# EAGLE schematic boarduino_breakout (EAGLE 4.16)
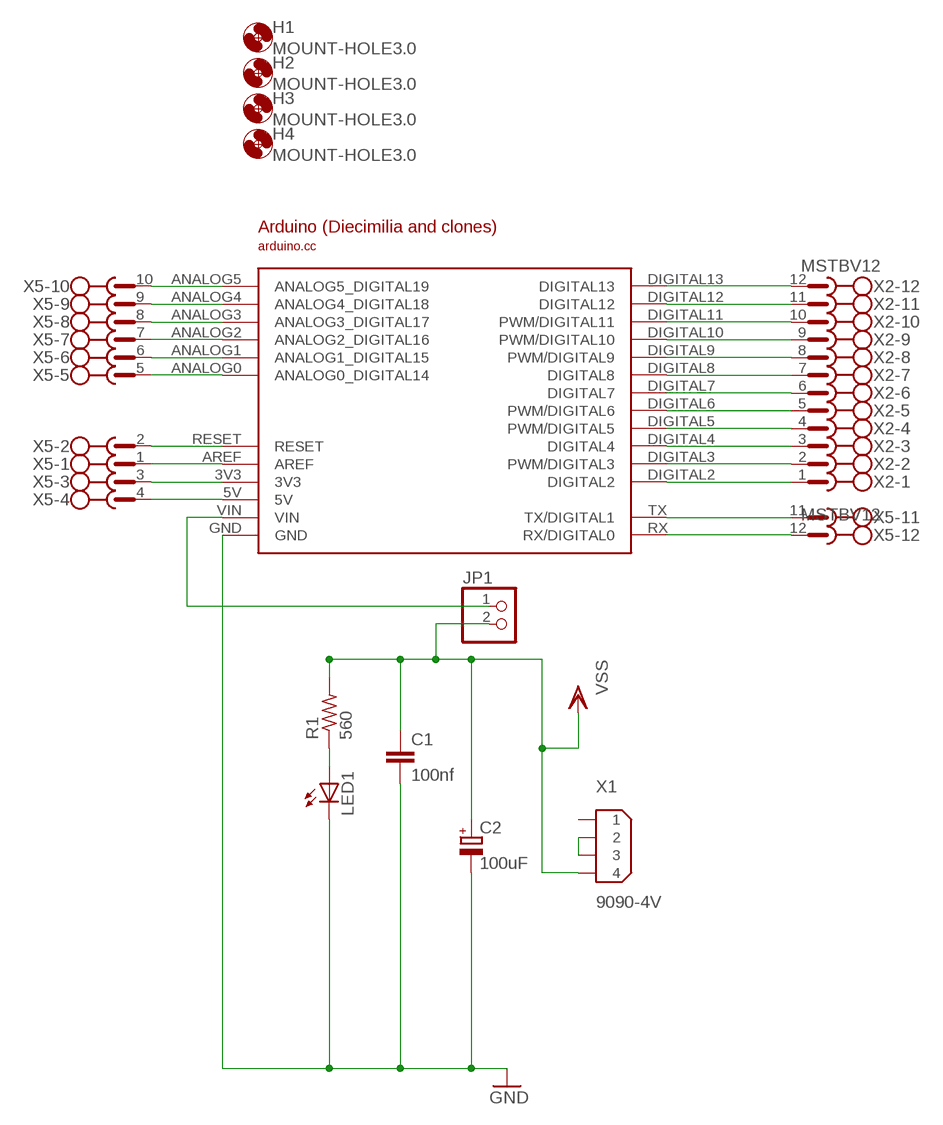
[diagram p0: schematic, sheet 1]

## Parts
C1  100nf  C-EU050-030X075  [C050-030X075]
C2  100uF  CPOL-EUE2.5-7  [E2,5-7]
H1  MOUNT-HOLE3.0  [3,0]
H2  MOUNT-HOLE3.0  [3,0]
H3  MOUNT-HOLE3.0  [3,0]
H4  MOUNT-HOLE3.0  [3,0]
JP1  PINHD-1X2  [1X02]
LED1  LED5MM  [LED5MM]
R1  560  R-US_0207/7  [0207/7]
U$1  ARDUINODIECIMILIA  [ARDUINO]
X1  9090-4V  [9090-4V]
X2  MSTBV12  [MSTBV12]
X5  MSTBV12  [MSTBV12]

## Nets
GND: C1.2 C2.- LED1.K(C) U$1.GND
N$1: LED1.A R1.1
N$2: X1.2 X1.3
N$3: U$1.DIGITAL13 X2.12
N$4: U$1.DIGITAL12 X2.11
N$5: U$1.DIGITAL11(PWM/DIGITAL11) X2.10
N$6: U$1.DIGITAL10(PWM/DIGITAL10) X2.9
N$7: U$1.DIGITAL9(PWM/DIGITAL9) X2.8
N$8: U$1.DIGITAL8 X2.7
N$9: U$1.DIGITAL7 X2.6
N$10: U$1.DIGITAL6(PWM/DIGITAL6) X2.5
N$11: U$1.DIGITAL5(PWM/DIGITAL5) X2.4
N$12: U$1.DIGITAL4 X2.3
N$13: U$1.DIGITAL3(PWM/DIGITAL3) X2.2
N$14: U$1.DIGITAL2 X2.1
N$15: U$1.TX(TX/DIGITAL1) X5.11
N$16: U$1.RX(RX/DIGITAL0) X5.12
N$17: U$1.ANALOG5(ANALOG5_DIGITAL19) X5.10
N$18: U$1.ANALOG4(ANALOG4_DIGITAL18) X5.9
N$19: U$1.ANALOG3(ANALOG3_DIGITAL17) X5.8
N$20: U$1.ANALOG2(ANALOG2_DIGITAL16) X5.7
N$21: U$1.ANALOG1(ANALOG1_DIGITAL15) X5.6
N$22: U$1.ANALOG0(ANALOG0_DIGITAL14) X5.5
N$23: U$1.AREF X5.1
N$24: U$1.RESET X5.2
N$25: U$1.3V3 X5.3
N$26: U$1.5V X5.4
N$27: JP1.1 U$1.VIN
VSS: C1.1 C2.+ JP1.2 R1.2 X1.4
Unconnected: X1.1

## Library data of the parts
C1 = rcl:C-EU: CAPACITOR, European symbol
C2 = rcl:CPOL-EU: POLARIZED CAPACITOR, European symbol
H1-H4 = holes:MOUNT-HOLE: MOUNTING HOLE with drill center marker
JP1 = pinhead:PINHD-1X2: PIN HEADER
LED1 = led:LED: LED OSRAM: - CHIPLED LG R971, LG N971, LY N971, LG Q971, LY Q971, LO R971, LY R971 LH N974, LH R974 LS Q976, LO Q976, LY Q976 LO Q996 - Hyper CHIPLED LW Q18S LB Q993, LB Q99A, LB R99A - SideLED LS A670, LO A670, LY A670, LG A670, LP A670 LB A673, LV A673, LT A673, LW A673 LH A674 LY A675 LS A676, LA A676, LO A676, LY A676, LW A676 LS A679, LY A679, LG A679 - Hyper Micro SIDELED® LS Y876, LA Y876, LO Y876, LY Y876 LT Y87S - SmartLED LW L88C, LW L88S LB L89C, LB L89S, LG L890 LS L89K, LO L89K, LY L89K LS L896, LA L896, LO L896, LY L896 - TOPLED LS T670, LO T670, LY T670, LG T670, LP T670 LSG T670, LSP T670, LSY T670, LOP T670, LYG T670 LG T671, LOG T671, LSG T671 LB T673, LV T673, LT T673, LW T673 LH T674 LS T676, LA T676, LO T676, LY T676, LB T676, LH T676, LSB T676, LW T676 LB T67C, LV T67C, LT T67C, LS T67K, LO T67K, LY T67K, LW E67C LS E67B, LA E67B, LO E67B, LY E67B, LB E67C, LV E67C, LT E67C LW T67C LS T679, LY T679, LG T679 LS T770, LO T770, LY T770, LG T770, LP T770 LB T773, LV T773, LT T773, LW T773 LH T774 LS E675, LA E675, LY E675, LS T675 LS T776, LA T776, LO T776, LY T776, LB T776 LHGB T686 LT T68C, LB T68C - Hyper Mini TOPLED® LB M676 - Mini TOPLED Santana® LG M470 LS M47K, LO M47K, LY M47K Source: http://www.osram.convergy.de - LUMILED® LXK2-PW12-R00, LXK2-PW12-S00, LXK2-PW14-U00, LXK2-PW14-V00 LXK2-PM12-R00, LXK2-PM12-S00, LXK2-PM14-U00 LXK2-PE12-Q00, LXK2-PE12-R00, LXK2-PE12-S00, LXK2-PE14-T00, LXK2-PE14-U00 LXK2-PB12-K00, LXK2-PB12-L00, LXK2-PB12-M00, LXK2-PB14-N00, LXK2-PB14-P00, LXK2-PB14-Q00 LXK2-PR12-L00, LXK2-PR12-M00, LXK2-PR14-Q00, LXK2-PR14-R00 LXK2-PD12-Q00, LXK2-PD12-R00, LXK2-PD12-S00 LXK2-PH12-R00, LXK2-PH12-S00 LXK2-PL12-P00, LXK2-PL12-Q00, LXK2-PL12-R00 Source: www.luxeon.com
R1 = rcl:R-US_: RESISTOR, American symbol
U$1 = reprap:ARDUINO
X1 = con-thomas-betts:9090-4: Disk Drive Power four position Source: Thomas & Betts Electronic Interconnects Eiropean Edition 1998
X2 X5 = con-phoenix-508:MSTBV12: PHOENIX

## Net classes
0 default: width 0.508 mm, drill 0.406 mm